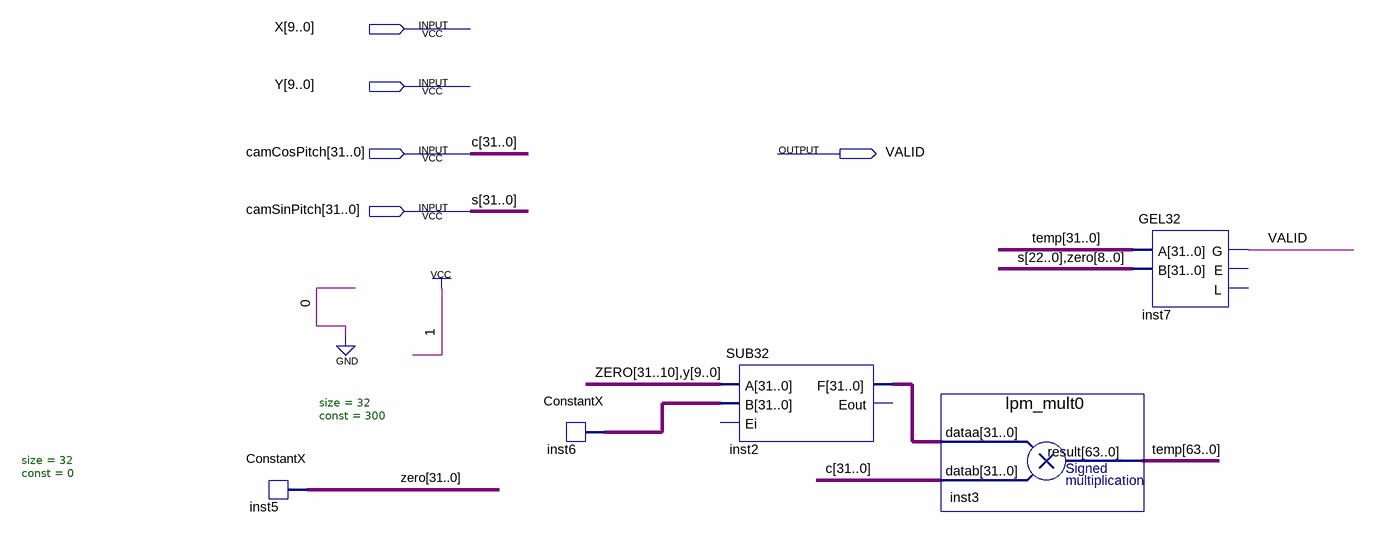
[diagram p0: schematic sheet]
// Quartus schematic layer_floor.bdf as structural Verilog: 5 symbols, 5 pins
module layer_floor (
  input  [9:0] X,
  input  [9:0] Y,
  input  [31:0] camCosPitch,
  input  [31:0] camSinPitch,
  output VALID
);

  wire [31:0] inst2_f, inst6_data_out, zero;
  wire [63:0] temp;

  ConstantX #(.size(32), .\const (0)) inst5 (.DATA_OUT(zero));
  ConstantX #(.size(32), .\const (300)) inst6 (.DATA_OUT(inst6_data_out));
  SUB32 inst2 (.A({zero[31:10], Y}), .B(inst6_data_out), .F(inst2_f));  // open: Ei, Eout
  lpm_mult0 inst3 (.dataa(inst2_f), .datab(camCosPitch), .result(temp));
  GEL32 inst7 (.A(temp[31:0]), .B({camSinPitch[22:0], zero[8:0]}), .G(VALID));  // open: E, L

  // Other names for the same wires on the sheet: c[31:0] = camCosPitch; s[31:0] = camSinPitch
endmodule
